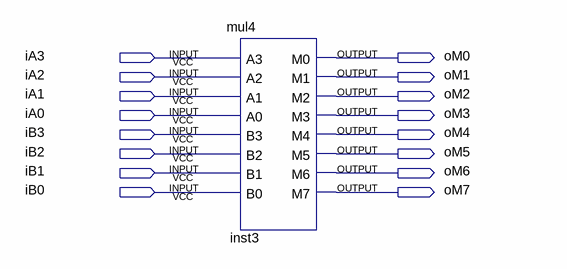
[diagram p0: schematic sheet]
// Quartus schematic mulu.bdf as structural Verilog: 1 symbols, 16 pins
module mulu (
  input  iA3,
  input  iA2,
  input  iA1,
  input  iA0,
  input  iB3,
  input  iB2,
  input  iB1,
  input  iB0,
  output oM0,
  output oM1,
  output oM2,
  output oM3,
  output oM4,
  output oM5,
  output oM6,
  output oM7
);

  mul4 inst3 (
    .A3(iA3), .A2(iA2), .A1(iA1), .A0(iA0), .B3(iB3), .B2(iB2), .B1(iB1), .B0(iB0), .M0(oM0), .M1(oM1),
    .M2(oM2), .M3(oM3), .M4(oM4), .M5(oM5), .M6(oM6), .M7(oM7));
endmodule
